# Altium project PCB_Project_Hearth.PrjPcb
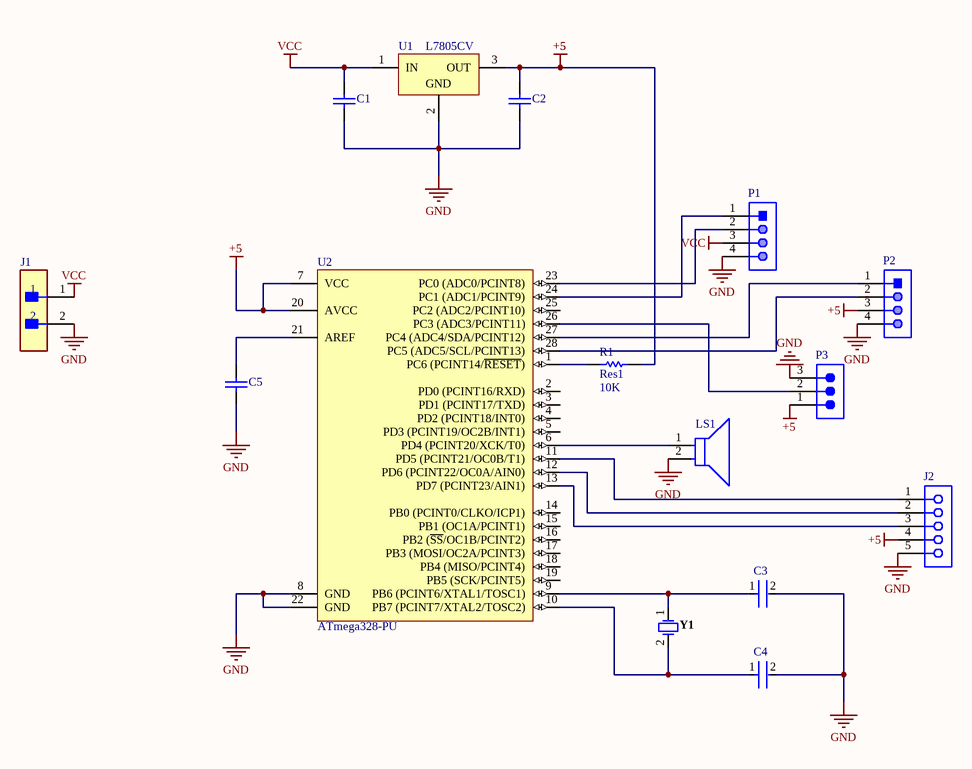
[diagram p0: Sheet_Hearth.SchDoc]
1 sheet, 15 parts. Net scope: global (net labels, ports and power ports of the same name join across sheets).
Board file: PCB_Hearth.PcbDoc

## Sheet Sheet_Hearth.SchDoc
size A; SheetNumber: 1; SheetTotal: 1

### Parts
C1  K104K15X7RF5TL2  [VISH-K104K15X7RF5TL2]  (value not drawn)
C2  K104K15X7RF5TL2  [VISH-K104K15X7RF5TL2]  (value not drawn)
C3  RCE5C1H220J0DBH03A  [FP-RCE0DB-MFG]  (value not drawn)
C4  RCE5C1H220J0DBH03A  [FP-RCE0DB-MFG]  (value not drawn)
C5  K104K15X7RF5TL2  [VISH-K104K15X7RF5TL2]  (value not drawn)
J1  TSW-102-07-L-S  [FP-TSW-102-07-L-S-MFG]  (value not drawn)
J2  SSQ-105-02-L-S-RA  [SMTC-SSQ-105-02-X-S-RA]  (value not drawn)
LS1  SD1209T5-A1  [FP-SD1209-MFG]  (value not drawn)
P1  61300411021  [61300411021]  (value not drawn)
P2  61300411021  [61300411021]  (value not drawn)
P3  MTSW-103-08-L-S-229-RA  [SMTC-MTSW-103-08-X-S-229-RA]  (value not drawn)
R1  Res1  value 10K  [AXIAL-0.3]
U1  L7805CV  [TO220]
U2  ATmega328-PU  [28P3]
Y1  FOXSLF/160-20  [FOX-FOXSLF160-20]  (value not drawn)

### Nets
+5: C2.2 J2.4 P2.3 P3.1 R1.2 U1.3(OUT) U2.7(VCC) U2.20(AVCC)
GND: C1.2 C2.1 C3.2 C4.2 C5.1 J1.2 J2.5 LS1.2(A) P1.4 P2.4 P3.3 U1.2(GND) U2.8(GND) U2.22(GND)
VCC: C1.1 J1.1 P1.3 U1.1(IN)
NetC3_1: C3.1 U2.9(PB6_(PCINT6/XTAL1/TOSC1)) Y1.1
NetC4_1: C4.1 U2.10(PB7_(PCINT7/XTAL2/TOSC2)) Y1.2
NetC5_2: C5.2 U2.21(AREF)
NetJ2_1: J2.1 U2.11(PD5_(PCINT21/OC0B/T1))
NetJ2_2: J2.2 U2.12(PD6_(PCINT22/OC0A/AIN0))
NetJ2_3: J2.3 U2.13(PD7_(PCINT23/AIN1))
NetLS1_1: LS1.1(C) U2.6(PD4_(PCINT20/XCK/T0))
NetP1_1: P1.1 U2.24(PC1_(ADC1/PCINT9))
NetP1_2: P1.2 U2.23(PC0_(ADC0/PCINT8))
NetP2_1: P2.1 U2.27(PC4_(ADC4/SDA/PCINT12))
NetP2_2: P2.2 U2.28(PC5_(ADC5/SCL/PCINT13))
NetP3_2: P3.2 U2.26(PC3_(ADC3/PCINT11))
NetR1_1: R1.1 U2.1(PC6_(PCINT14/~{RESET}))

Not connected (* = marked no-connect by the designer): U2 2(PD0_(PCINT16/RXD)) 3(PD1_(PCINT17/TXD)) 4(PD2_(PCINT18/INT0)) 5(PD3_(PCINT19/OC2B/INT1)) 14(PB0_(PCINT0/CLKO/ICP1)) 15(PB1_(OC1A/PCINT1)) 16(PB2_(~{SS}/OC1B/PCINT2)) 17(PB3_(MOSI/OC2A/PCINT3)) 18(PB4_(MISO/PCINT4)) 19(PB5_(SCK/PCINT5)) 25(PC2_(ADC2/PCINT10))

### Library data of the parts
C1 C2 C5 = CMP-2000-06508-1: Ceramic Capacitor, 100 nF, +/- 10%, 50 V, -55 to 125 degC, 2-Pin THD, RoHS, Tape and Reel; Manufacturer: Vishay; Other Names: BC1084CT; Catalog Drawings: Mono-KapSide2-15_5.58Mono-KapSide1_15; Temperature Coefficient: X7R; Voltage - Rated: 50V; Online Catalog: Mono-Kap™Series; Capacitance: 0.1µF; Size / Dimension: 0.157"Lx0.098"W(4.00mmx2.50mm); Operating Temperature: -55°C~125°C; Family: CeramicCapacitors; Manufacturer URL: http://www.vishay.com/; Standard Package: 1; Thickness (Max): -; Ratings: -; Datasheet Version: 08/2013; Package Description: 2-Pin Through Hole Device, Body 4 x 2.6 mm; Mounting Type: ThroughHole; Features: -; Lead Spacing: 0.098"(2.50mm); Tolerance: ±10%; Category: Capacitors; Mounting Technology: ThroughHole; Lead Style: Straight; Datasheet URL: http://www.vishay.com/docs/45171/kseries.pdf; Applications: GeneralPurpose; Package / Case: Radial; Height - Seated (Max): 0.220"(5.58mm); Package Reference: K104K15X7RF5TL2; Series: Mono-Kap™K; Packaging: CutTape(CT)
C3 C4 = CMP-06035-057691-1: Cap Ceramic 22pF 50V C0G ±5% Radial 2.5mm +125°C Ammo Pack; Lead Diameter: 0.5mm; Lead/Base Style: Straight; Termination: Radial; Height - Seated (Max): 0.138inch; Capacitance: 22pF; Height: 3.5mm; Dielectric: C0G; Voltage Rating (DC): 50V; Tolerance: 5%; Package Quantity: 2000; Max Operating Temperature: 125°C; Min Operating Temperature: -55°C; Packaging: Tape and Reel; Lead Pitch: 0.098inch; Mount: Through Hole; Length: 0.142inch; Voltage Rating: 50V; Resistor Type: Ceramic; Ratings: AEC-Q200; Case/Package: Radial; Width: 0.098inch
J1 = CMP-02766-001428-1: CONN HEADER VERT 2POS 2.54MM; Voltage Rating: 550V; Current Rating: 7.6A; Gender: Male; Number of Contacts: 2; Connector Type: Male Pin; Radiation Hardening: No; Orientation: Straight; Contact Plating: Gold; Max Operating Temperature: 125°C; Mount: Through Hole; Package Quantity: 1; Number of Rows: 1; Housing Material: Polyester; RoHS Compliant: Yes; Length: 5.08mm; Max Voltage Rating (AC): 550V; Pitch: 2.54mm; Packaging: Bulk; Depth: 2.54mm; Termination: Solder; Min Operating Temperature: -55°C; Housing Color: Black; Lead Free: Lead Free; Color: Black; Number of Positions: 2; Width: 2.54mm; Max Current Rating: 7.6A; REACH SVHC: No SVHC; Contact Material: Bronze; Contact Mating Length: 0.23inch; Series: TSW; Contact Type: Male Pin
J2 = CMP-1023-00283-1: SQ Post Socket, Through-hole, Right Angle, -55 to 125 degC, 2.54 mm Pitch, 5-Pin, Female, RoHS; Manufacturer: Samtec; Pitch: 2.54 mm; ComponentLink2Description: Datasheet; Temperature Range: -55 to 125 degC; PackageDescription: Assembly, Socket Strip .025[0.64] SQ Tail; Orientation: Right Angle; ComponentLink1Description: Manufacturer URL; PackageVersion: BD, 6/1987; RoHS: True; DatasheetVersion: F-214; Mounting Technology: Through-hole; ComponentLink3Description: Package Specification; ComponentLink3URL: http://www.samtec.com/documents/webfiles/cpdf/SSQ-1XX-XX-XXX-X-XX-XXX-XX-X-MKT.pdf; PackageReference: SSQ-105-02-X-S-RA; PartNumber: SSQ-105-02-L-S-RA; ComponentLink2URL: http://www.samtec.com/documents/webfiles/pdf/SSQ_TH.PDF; ComponentLink1URL: http://www.samtec.com
LS1 = CMP-08413-000009-1: AUDIO MAGNETIC XDCR 3-6V TH; Max Supply Current: 60mA; Number of Terminals/Pins: 2; Frequency: 2.048kHz; Washable: No; Operating Supply Voltage: 5V; Self Resonant Frequency: 2.05kHz; Min Operating Temperature: -40°C; Operating Supply Current: 60mA; Diameter: 12mm; Package Quantity: 100; Max Operating Temperature: 85°C; Sensing Method: Magnetic; Series: SD; Current Rating: 60mA; Lead Free: Lead Free; Height: 9mm; Packaging: Tray; Termination: PC Pins; Number of Pins: 2; Voltage Rating (DC): 5V; Mount: Through Hole
P1 P2 = CMP-1502-01063-1: THT Angled Pin Header WR-PHD, Pitch 2.54 mm, Single Row, 4 pins; Manufacturer: Wurth Elektronik; Gender: Male; Pin Number: 4; Withstanding Voltage: 500VAC; Working Voltage: 250VAC; Contact Resistance: 20mOhm; Pitch: 2.54mm; Rated Current: 3A; Manufacturer URL: http://www.we-online.de; Mounting Technology: THT; Publisher: WurthElektronik; Operating Temperature: -40to105degC; Packaging: Bag; Row Number: Single; Package Reference: 61300411021; Part Number: 61300411021; Orientation: Angled; Datasheet URL: https://katalog.we-online.de/em/datasheet/6130xx11021.pdf
P3 = CMP-1024-00103-1: Modified .025" SQ Post Header, Through-hole, Right Angle, -55 to 125 degC, 2.54 mm Pitch, 3-Pin, Male, RoHS; Manufacturer: Samtec; Pitch: 2.54 mm; DatasheetVersion: F-214; Mounting Technology: Through-hole; PackageDescription: Assembly .025" [.64] SQ Post Terminal Strip; Temperature Range: -55 to 125 degC; PackageVersion: BI, 2/1987; Orientation: Right Angle; ComponentLink3Description: Package Specification; PackageReference: MTSW-103-08-X-S-229-RA; RoHS: True; ComponentLink2URL: http://www.samtec.com/documents/webfiles/pdf/MTSW.PDF; ComponentLink3URL: http://www.samtec.com/documents/webfiles/cpdf/MTSW-XXX-XX-X-X-XXXX-XX-XXX-MKT1.pdf; PartNumber: MTSW-103-08-L-S-229-RA; ComponentLink2Description: Datasheet; ComponentLink1Description: Manufacturer URL; ComponentLink1URL: http://www.samtec.com
R1 = Res1: Resistor; Published: 8-Jun-2000; LatestRevisionDate: 17-Jul-2002; LatestRevisionNote: Re-released for DXP Platform.; PackageReference: AXIAL-0.3; Publisher: Altium Limited; PackageDescription: Axial Device, Thru-Hole; 2 Leads; 0.3 in Pin Spacing
U1 = CMP-0244-00483-1: Positive Voltage Regulator, 5V, 3-Pin TO-220; PackageDescription: TO, Thru-Hole, Vertical, Heatsink Mounted; 3 In-Line Leads; Pitch 2.54 mm; ComponentLink2Description: Datasheet; PackageReference: TO220; ComponentLink3URL: http://www.st.com/internet/com/TECHNICAL_RESOURCES/TECHNICAL_LITERATURE/PACKAGE_INFORMATION/CD00004649.pdf; DatasheetVersion: 16/11/2011; ComponentLink1Description: Manufacturer URL; ComponentLink1URL: http://www.st.com; PackageVersion: ver3.0; ComponentLink3Description: Package Specification; ComponentLink2URL: http://www.st.com/internet/com/TECHNICAL_RESOURCES/TECHNICAL_LITERATURE/DATASHEET/CD00000444.pdf
U2 = CMP-0095-00015-2: 8-bit AVR Microcontroller, 32KB Flash, 1KB EEPROM, 2KB SRAM, 28-pin PDIP, Industrial Grade (-40°C to 85°C); ComponentLink3Description: ATmega48A/48PA/88A/88PA/168A/168PA/328/328P Summary; RevisionNote: DatasheetVersion updated. URLs added.; DatasheetVersion: revD, May-2011; ComponentLink1URL: http://www.atmel.com/; PackageVersion: revB, Sep-2001; PackageDescription: 28-lead (0.300"/7.62mm Wide) Plastic Dual Inline Package (PDIP); PackageReference: 28P3; ComponentLink1Description: Manufacturer URL; ComponentLink2Description: ATmega48A/48PA/88A/88PA/168A/168PA/328/328P Datasheet; ComponentLink3URL: http://www.atmel.com/dyn/resources/prod_documents/8271S.pdf; ComponentLink2URL: http://www.atmel.com/dyn/resources/prod_documents/8271.pdf
Y1 = CMP-1749-00003-1: Resistance Weld Thru-Hole Crystal, 16 MHz, -20 to 70 degC, 2-Pin THD, RoHS, Bulk; Voltage Rating: 250 V; Tolerance: 1%; Resistance: 221 kohm; Case\Package: Axial; Power Rating: 250 mW; RoHSCompliant: true; Package Quantity: 200; Packaging: Bulk; Min Operating Temperature: -55 degC; DatasheetVersion: Mar-15; ComponentLink1URL: http://www.foxonline.com/; Max Operating Temperature: 155 degC; PackageReference: FOXSLF160-20; Mount: Through Hole; PackageDescription: 2-Pin Through Hole Device, Body 11.35 x 4.65 mm; ComponentLink1Description: Manufacturer URL; ComponentLink2URL: http://www.foxonline.com/pdfs/hc49slf.pdf; ComponentLink2Description: Datasheet; Length: 0.248 inch